# Altium schematic sheet 3_baseband.SchDoc: LoRa Baseband processor
size A4; OrganizationName: Pluton UPV; Address1: Universitat Politècnica; Address2: de València (UPV); Address3: Camí de Vera, València; Address4: Spain; SheetNumber: 3; SheetTotal: 6
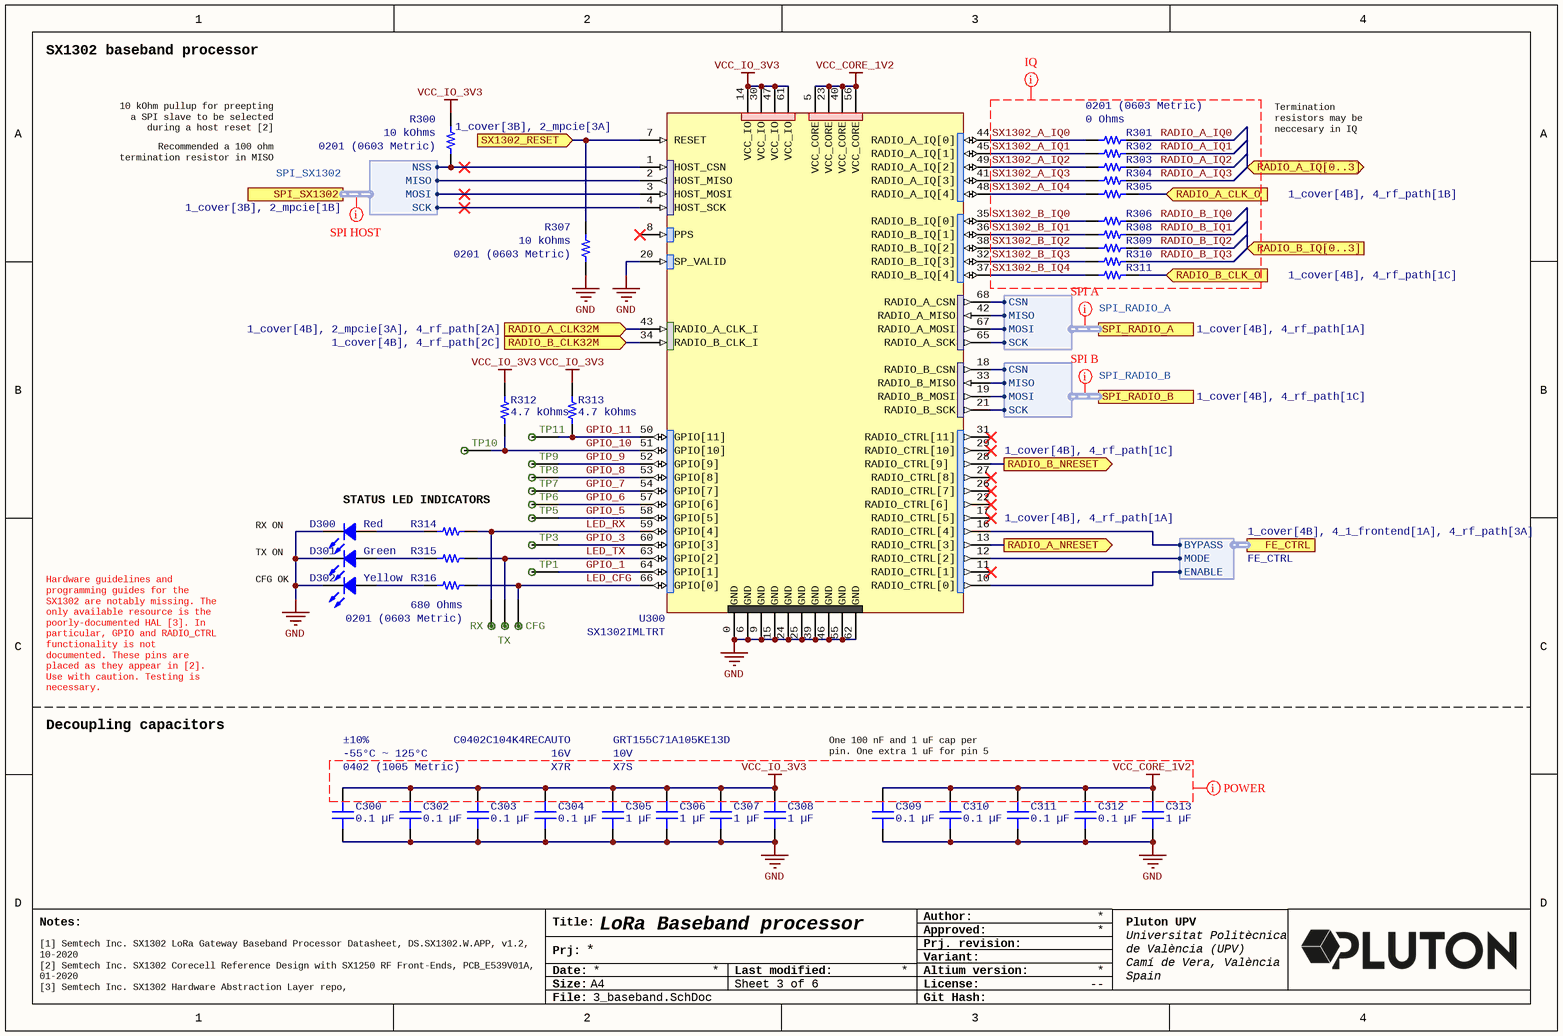
[diagram p0: 3_baseband.SchDoc]

## Parts
C300  Part Number: C0402C104K4RECAUTO  Operating Temperature: -55°C ~ 125°C  Package / Case: 0402 (1005 Metric)  Temperature Coefficient: X7R  Tolerance: ±10%  Voltage - Rated: 16V  [CAP 0402_1005]  (hidden comment: 0.1 µF)
C302  0.1 µF  [CAP 0402_1005]
C303  0.1 µF  [CAP 0402_1005]
C304  0.1 µF  [CAP 0402_1005]
C305  Part Number: GRT155C71A105KE13D  Temperature Coefficient: X7S  Voltage - Rated: 10V  [CAP 0402_1005]  (hidden comment: 1 µF)
C306  1 µF  [CAP 0402_1005]
C307  1 µF  [CAP 0402_1005]
C308  1 µF  [CAP 0402_1005]
C309  0.1 µF  [CAP 0402_1005]
C310  0.1 µF  [CAP 0402_1005]
C311  0.1 µF  [CAP 0402_1005]
C312  0.1 µF  [CAP 0402_1005]
C313  1 µF  [CAP 0402_1005]
CFG  (no value)  [testpoint_via]  (no BOM)
D300  Red  [LED 0402_1005 RED]
D301  Green  [LED 0402_1005 GREEN]
D302  Yellow  [LED 0402_1005 YELLOW]
R300  Package / Case: 0201 (0603 Metric)  [RES 0201_0603]  (hidden comment: 10 kOhms)
R301  Device Package: 0201 (0603 Metric)  [RES 0201_0603]  (hidden comment: 0 Ohms)
R302  0 Ohms  [RES 0201_0603]  (value not drawn)
R303  0 Ohms  [RES 0201_0603]  (value not drawn)
R304  0 Ohms  [RES 0201_0603]  (value not drawn)
R305  0 Ohms  [RES 0201_0603]  (value not drawn)
R306  0 Ohms  [RES 0201_0603]  (value not drawn)
R307  Package / Case: 0201 (0603 Metric)  [RES 0201_0603]  (hidden comment: 10 kOhms)
R308  0 Ohms  [RES 0201_0603]  (value not drawn)
R309  0 Ohms  [RES 0201_0603]  (value not drawn)
R310  0 Ohms  [RES 0201_0603]  (value not drawn)
R311  0 Ohms  [RES 0201_0603]  (value not drawn)
R312  4.7 kOhms  [RES 0201_0603]
R313  4.7 kOhms  [RES 0201_0603]
R314  680 Ohms  [RES 0201_0603]  (value not drawn)
R315  680 Ohms  [RES 0201_0603]  (value not drawn)
R316  Device Package: 0201 (0603 Metric)  [RES 0201_0603]  (hidden comment: 680 Ohms)
RX  (no value)  [testpoint_via]  (no BOM)
TP1  (no value)  [testpoint_pad]  (no BOM)
TP3  (no value)  [testpoint_pad]  (no BOM)
TP5  (no value)  [testpoint_pad]  (no BOM)
TP6  (no value)  [testpoint_pad]  (no BOM)
TP7  (no value)  [testpoint_pad]  (no BOM)
TP8  (no value)  [testpoint_pad]  (no BOM)
TP9  (no value)  [testpoint_pad]  (no BOM)
TP10  (no value)  [testpoint_pad]  (no BOM)
TP11  (no value)  [testpoint_pad]  (no BOM)
TX  (no value)  [testpoint_via]  (no BOM)
U300  SX1302IMLTRT  [QFN-68]

## Ports
FE_CTRL (harness FE_CTRL, see 1_cover[4B], 4_1_frontend[1A], 4_rf_path[3A]), RADIO_A_CLK32M (in, see 1_cover[4B], 2_mpcie[3A], 4_rf_path[2A]), RADIO_A_CLK_O (in, see 1_cover[4B], 4_rf_path[1B]), RADIO_A_IQ[0..3] (bidir, see 1_cover[4B], 4_rf_path[1B]), RADIO_A_NRESET (out, see 1_cover[4B], 4_rf_path[1A]), RADIO_B_CLK32M (in, see 1_cover[4B], 4_rf_path[2C]), RADIO_B_CLK_O (in, see 1_cover[4B], 4_rf_path[1C]), RADIO_B_IQ[0..3] (in, see 1_cover[4B], 4_rf_path[1C]), RADIO_B_NRESET (out, see 1_cover[4B], 4_rf_path[1C]), SPI_RADIO_A (harness SPI_RADIO_A, see 1_cover[4B], 4_rf_path[1A]), SPI_RADIO_B (harness SPI_RADIO_B, see 1_cover[4B], 4_rf_path[1C]), SPI_SX1302 (harness SPI_SX1302, see 1_cover[3B], 2_mpcie[1B]), SX1302_RESET (in, see 1_cover[3B], 2_mpcie[3A])

## Harnesses
SPI_RADIO_A: CSN, MISO, MOSI, SCK
SPI_RADIO_B: CSN, MISO, MOSI, SCK
SPI_SX1302: SCK, MISO, MOSI, NSS
FE_CTRL: MODE, ENABLE, BYPASS

## Nets
GND: C300.1 C302.1 C303.1 C304.1 C305.1 C306.1 C307.1 C308.1 C309.1 C310.1 C311.1 C312.1 C313.1 D300.2 D301.2 D302.2 R307.2 U300.0(GND) U300.6(GND) U300.9(GND) U300.15(GND) U300.20(SP_VALID) U300.24(GND) U300.25(GND) U300.39(GND) U300.46(GND) U300.55(GND) U300.62(GND)
VCC_CORE_1V2: C309.2 C310.2 C311.2 C312.2 C313.2 U300.5(VCC_CORE) U300.23(VCC_CORE) U300.40(VCC_CORE) U300.56(VCC_CORE)
VCC_IO_3V3: C300.2 C302.2 C303.2 C304.2 C305.2 C306.2 C307.2 C308.2 R300.1 R312.2 R313.2 U300.14(VCC_IO) U300.30(VCC_IO) U300.47(VCC_IO) U300.61(VCC_IO)
GPIO_1: TP1.0 U300.64(GPIO[1])
GPIO_3: TP3.0 U300.60(GPIO[3])
GPIO_5: TP5.0 U300.58(GPIO[5])
GPIO_6: TP6.0 U300.57(GPIO[6])
GPIO_7: TP7.0 U300.54(GPIO[7])
GPIO_8: TP8.0 U300.53(GPIO[8])
GPIO_9: TP9.0 U300.52(GPIO[9])
GPIO_10: R312.1 TP10.0 U300.51(GPIO[10])
GPIO_11: R313.1 TP11.0 U300.50(GPIO[11])
LED_CFG: CFG.0 R316.2 U300.66(GPIO[0])
LED_RX: R314.2 RX.0 U300.59(GPIO[4])
LED_TX: R315.2 TX.0 U300.63(GPIO[2])
RADIO_A_CLK32M: U300.43(RADIO_A_CLK_I) ; port RADIO_A_CLK32M
RADIO_A_CLK_O: R305.2 ; port RADIO_A_CLK_O
RADIO_A_IQ0: R301.2
RADIO_A_IQ1: R302.2
RADIO_A_IQ2: R303.2
RADIO_A_IQ3: R304.2
RADIO_A_NRESET: U300.13(RADIO_CTRL[3]) ; port RADIO_A_NRESET
RADIO_B_CLK32M: U300.34(RADIO_B_CLK_I) ; port RADIO_B_CLK32M
RADIO_B_CLK_O: R311.2 ; port RADIO_B_CLK_O
RADIO_B_IQ0: R306.2
RADIO_B_IQ1: R308.2
RADIO_B_IQ2: R309.2
RADIO_B_IQ3: R310.2
RADIO_B_NRESET: U300.28(RADIO_CTRL[9]) ; port RADIO_B_NRESET
SX1302_A_IQ0: R301.1 U300.44(RADIO_A_IQ[0])
SX1302_A_IQ1: R302.1 U300.45(RADIO_A_IQ[1])
SX1302_A_IQ2: R303.1 U300.49(RADIO_A_IQ[2])
SX1302_A_IQ3: R304.1 U300.41(RADIO_A_IQ[3])
SX1302_A_IQ4: R305.1 U300.48(RADIO_A_IQ[4])
SX1302_B_IQ0: R306.1 U300.35(RADIO_B_IQ[0])
SX1302_B_IQ1: R308.1 U300.36(RADIO_B_IQ[1])
SX1302_B_IQ2: R309.1 U300.38(RADIO_B_IQ[2])
SX1302_B_IQ3: R310.1 U300.32(RADIO_B_IQ[3])
SX1302_B_IQ4: R311.1 U300.37(RADIO_B_IQ[4])
SX1302_RESET: R307.1 U300.7(RESET) ; port SX1302_RESET
NetD300_1: D300.1 R314.1
NetD301_1: D301.1 R315.1
NetD302_1: D302.1 R316.1
NetR300_2: R300.2 U300.1(HOST_CSN) ; port SPI_SX1302.NSS
NetU300_2: U300.2(HOST_MISO) ; port SPI_SX1302.MISO
NetU300_3: U300.3(HOST_MOSI) ; port SPI_SX1302.MOSI
NetU300_4: U300.4(HOST_SCK) ; port SPI_SX1302.SCK
NetU300_10: U300.10(RADIO_CTRL[0]) ; port FE_CTRL.ENABLE
NetU300_12: U300.12(RADIO_CTRL[2]) ; port FE_CTRL.MODE
NetU300_16: U300.16(RADIO_CTRL[4]) ; port FE_CTRL.BYPASS
NetU300_18: U300.18(RADIO_B_CSN) ; port SPI_RADIO_B.CSN
NetU300_19: U300.19(RADIO_B_MOSI) ; port SPI_RADIO_B.MOSI
NetU300_21: U300.21(RADIO_B_SCK) ; port SPI_RADIO_B.SCK
NetU300_33: U300.33(RADIO_B_MISO) ; port SPI_RADIO_B.MISO
NetU300_42: U300.42(RADIO_A_MISO) ; port SPI_RADIO_A.MISO
NetU300_65: U300.65(RADIO_A_SCK) ; port SPI_RADIO_A.SCK
NetU300_67: U300.67(RADIO_A_MOSI) ; port SPI_RADIO_A.MOSI
NetU300_68: U300.68(RADIO_A_CSN) ; port SPI_RADIO_A.CSN

Not connected (* = marked no-connect by the designer): U300 8(PPS)* 11(RADIO_CTRL[1])* 17(RADIO_CTRL[5])* 22(RADIO_CTRL[6]_)* 26(RADIO_CTRL[7])* 27(RADIO_CTRL[8])* 29(RADIO_CTRL[10])* 31(RADIO_CTRL[11])*

## Layout directives
net class SPI HOST; rule Matched Net Lengths [Tolerance = 20mm]: (no net found under the mark)
net class IQ; rule Matched Net Lengths [Tolerance = 20mm]: RADIO_A_IQ0, RADIO_A_IQ1, RADIO_A_IQ2, RADIO_A_IQ3, RADIO_B_IQ0, RADIO_B_IQ1, RADIO_B_IQ2, RADIO_B_IQ3, SX1302_A_IQ0, SX1302_A_IQ1, SX1302_A_IQ2, SX1302_A_IQ3, SX1302_A_IQ4, SX1302_B_IQ0, SX1302_B_IQ1, SX1302_B_IQ2, SX1302_B_IQ3, SX1302_B_IQ4
net class SPI A; rule Matched Net Lengths [Tolerance = 20mm]: (no net found under the mark)
net class SPI B; rule Matched Net Lengths [Tolerance = 20mm]: (no net found under the mark)
rule Width Constraint [Pref Width = 0.4mm    Min Width = 0.2mm    Max Width = 0.5mm]; net class POWER: VCC_CORE_1V2, VCC_IO_3V3

## Notes on the sheet
- SX1302 baseband processor
- Recommended a 100 ohm
  termination resistor in MISO [2]
- 10 kOhm pullup for preepting
  a SPI slave to be selected
  during a host reset [2]
- Termination resistors may be neccesary in IQ pins [2]
- STATUS LED INDICATORS
- CFG OK
- TX ON
- RX ON
- Hardware guidelines and programming guides for the SX1302 are notably missing. The only available resource is the poorly-documented HAL [3]. In particular, GPIO and RADIO_CTRL functionality is not documented. These pins are placed as they appear in [2].
  Use with caution. Testing is necessary.
- Decoupling capacitors
- One 100 nF and 1 uF cap per pin. One extra 1 uF for pin 5 [2]
- [1] Semtech Inc. SX1302 LoRa Gateway Baseband Processor Datasheet, DS.SX1302.W.APP, v1.2, 10-2020
  [2] Semtech Inc. SX1302 Corecell Reference Design with SX1250 RF Front-Ends, PCB_E539V01A, 01-2020
  [3] Semtech Inc. SX1302 Hardware Abstraction Layer repo, https://github.com/Lora-net/sx1302_hal
- Notes:
- Title:
- Author:
- Approved:
- Date:
- Prj:
- Size:
- A4
- Last modified:
- Altium version:
- Variant:
- Prj. revision:
- License:
- --
- File:
- Git Hash:

## Library data of the parts
C300 C302-C304 C309-C312 = C0402C104K4RECAUTO: CAP CER 0402 0.1UF 16V X7R 10%; manufacturer: KEMET; Value: 0.1 µF; Applications: Automotive, ESD Protection; Capacitance: 0.1 µF; componentlink1description: Datasheet; componentlink1url: https://api.kemet.com/component-edge/download/datasheet/C0402C104K4RECAUTO.pdf; componentlink2description: DigiKey Link; componentlink2url: https://www.digikey.com/en/products/detail/kemet/C0402C104K4RECAUTO/8563695; Device Package: 0402 (1005 Metric); lastupdated: 09/02/2024 20:04:38; Lifecycle Status: Active; Minimum Order: 1; Mounting Type: Surface Mount, MLCC; packaging: TapeAndReel; partid: 1731; Part Status: Active; price: 0.01; Ratings: AEC-Q200; series: ESD SMD Auto X7R; Size / Dimension: 0.039" L x 0.020" W (1.00mm x 0.50mm); Supplier 1: DigiKey; Supplier Part Number 1: 399-17167-1-ND; Thickness (Max): 0.022" (0.55mm)
  C302-C304 C309-C312: Part Number: C0402C104K4RECAUTO; Operating Temperature: -55°C ~ 125°C; Package / Case: 0402 (1005 Metric); Temperature Coefficient: X7R; Tolerance: ±10%; Voltage - Rated: 16V
C305-C308 C313 = GRT155C71A105KE13D: CAP CER 1UF 10V X7S 0402; manufacturer: Murata Electronics; Tolerance: ±10%; Value: 1 µF; Applications: Automotive; Capacitance: 1 µF; componentlink1description: Datasheet; componentlink1url: https://search.murata.co.jp/Ceramy/image/img/A01X/G101/ENG/GRT155C71A105KE13-01.pdf; componentlink2description: DigiKey Link; componentlink2url: https://www.digikey.com/en/products/detail/murata-electronics/GRT155C71A105KE13D/10695747; Device Package: 0402 (1005 Metric); lastupdated: 09/02/2024 20:04:05; Lifecycle Status: Active; Minimum Order: 1; Mounting Type: Surface Mount, MLCC; Operating Temperature: -55°C ~ 125°C; Package / Case: 0402 (1005 Metric); packaging: TapeAndReel; partid: 47127; Part Status: Active; price: 0.04; Ratings: AEC-Q200; series: GRT; Size / Dimension: 0.039" L x 0.020" W (1.00mm x 0.50mm); Supplier 1: DigiKey; Supplier Part Number 1: 490-GRT155C71A105KE13DCT-ND; Thickness (Max): 0.024" (0.60mm)
  C306-C308 C313: Part Number: GRT155C71A105KE13D; Temperature Coefficient: X7S; Voltage - Rated: 10V
CFG RX TX = TestPoint-VIA: Test point, thru-hole
D300 = EAST10053RA0: LED RED CLEAR 2SMD; Manufacturer: Everlight Electronics Co Ltd; Configuration: Standard; Current - Test: 5mA; Lens Color: Colorless; Lens Size: 1.00mm x 0.50mm; Lens Style: Rectangle with Flat Top; Viewing Angle: 120°; Voltage - Forward (Vf) (Typ): 2.05V; Wavelength - Peak: 639nm; Part Number: EAST10053RA0; Color: Red; ComponentLink1Description: Datasheet; ComponentLink1URL: https://everlightamericas.com/index.php?controller=attachment&id_attachment=3575; ComponentLink2Description: DigiKey Link; ComponentLink2URL: https://www.digikey.com/en/products/detail/everlight-electronics-co-ltd/EAST10053RA0/8510365; Device Package: 0402 (1005 Metric); Height (Max): 0.35mm; LastUpdated: 03/06/2024 19:59:17; Lens Transparency: Clear; Lifecycle Status: Active; Minimum Order: 1; Mounting Type: Surface Mount; Package / Case: 0402 (1005 Metric); Packaging: TapeAndReel; PartId: 508; Part Status: Active; Price: 0.05; Series: -; Size / Dimension: 1.00mm L x 0.50mm W; Supplier 1: DigiKey; Supplier Part Number 1: 1080-1556-1-ND; Supplier Device Package: 2-SMD; Value: Red
D301 = EAST10052GA0: LED GREEN CLEAR 2SMD; Manufacturer: Everlight Electronics Co Ltd; Configuration: Standard; Current - Test: 5mA; Lens Color: Colorless; Lens Size: 1.00mm x 0.50mm; Lens Style: Rectangle with Flat Top; Viewing Angle: 120°; Voltage - Forward (Vf) (Typ): 2.95V; Wavelength - Peak: 518nm; Part Number: EAST10052GA0; Color: Green; ComponentLink1Description: Datasheet; ComponentLink1URL: https://everlightamericas.com/index.php?controller=attachment&id_attachment=3256; ComponentLink2Description: DigiKey Link; ComponentLink2URL: https://www.digikey.com/en/products/detail/everlight-electronics-co-ltd/EAST10052GA0/8510366; Device Package: 0402 (1005 Metric); Height (Max): 0.25mm; LastUpdated: 03/06/2024 19:58:14; Lens Transparency: Clear; Lifecycle Status: Active; Minimum Order: 1; Mounting Type: Surface Mount; Package / Case: 0402 (1005 Metric); Packaging: TapeAndReel; PartId: 696; Part Status: Active; Price: 0.09; Series: -; Size / Dimension: 1.00mm L x 0.50mm W; Supplier 1: DigiKey; Supplier Part Number 1: 1080-1557-1-ND; Supplier Device Package: 2-SMD; Value: Green
D302 = FHY1105P-TR: LED YELLOW CLEAR 1005 SMD; Manufacturer: Stanley Electric Co; Configuration: Standard; Current - Test: 5mA; Lens Color: Colorless; Lens Size: 1.00mm x 0.50mm; Lens Style: Rectangle with Flat Top; Millicandela Rating: 32mcd; Voltage - Forward (Vf) (Typ): 1.9V; Wavelength - Dominant: 590nm; Wavelength - Peak: 594nm; Part Number: FHY1105P-TR; Color: Yellow; ComponentLink1Description: Datasheet; ComponentLink1URL: http://www.stanley-components.com/php/downloaddatafile.php?rp=0,FHY1105P-TR_e.pdf; ComponentLink2Description: DigiKey Link; ComponentLink2URL: https://www.digikey.com/en/products/detail/stanley-electric-co/FHY1105P-TR/6205303; Device Package: 0402 (1005 Metric); Height (Max): 0.25mm; LastUpdated: 03/06/2024 20:00:47; Lens Transparency: Clear; Lifecycle Status: Active; Minimum Order: 1; Mounting Type: Surface Mount; Package / Case: 0402 (1005 Metric); Packaging: TapeAndReel; PartId: 166; Part Status: Active; Price: 0.05; Series: -; Size / Dimension: 1.00mm L x 0.50mm W; Supplier 1: DigiKey; Supplier Part Number 1: 404-1209-1-ND; Supplier Device Package: 1005; Value: Yellow
R300 R307 = AF0201FR-0710KL: RES SMD 10K OHM 1% 1/20W 0201; Manufacturer: Yageo; Power (Watts): 0.05W, 1/20W; Temperature Coefficient: ±200ppm/°C; Part Number: AF0201FR-0710KL; Value: 10 kOhms; ComponentLink1Description: Datasheet; ComponentLink1URL: https://www.yageo.com/upload/media/product/productsearch/datasheet/rchip/PYu-AF_51_RoHS_L_9.pdf; ComponentLink2Description: DigiKey Link; ComponentLink2URL: https://www.digikey.com/en/products/detail/yageo/AF0201FR-0710KL/5900138; Composition: Thick Film; Device Package: 0201 (0603 Metric); Features: Anti-Sulfur, Automotive AEC-Q200; Height - Seated (Max): 0.010" (0.26mm); LastUpdated: 04/06/2024 19:11:47; Lifecycle Status: Active; Minimum Order: 1; Number of Terminations: 2; Operating Temperature: -55°C ~ 125°C; Packaging: TapeAndReel; PartId: 78061; Part Status: Active; Price: 0.01; Ratings: AEC-Q200; Resistance: 10 kOhms; Series: AF; Size / Dimension: 0.024" L x 0.012" W (0.60mm x 0.30mm); Supplier 1: DigiKey; Supplier Part Number 1: 13-AF0201FR-0710KLCT-ND; Supplier Device Package: 0201; Tolerance: ±1%
R301-R306 R308-R311 = AC0201JR-070RL: RES SMD 0 OHM JUMPER 1/20W 0201; Manufacturer: Yageo; Power (Watts): 0.05W, 1/20W; Part Number: AC0201JR-070RL; Value: 0 Ohms; ComponentLink1Description: Datasheet; ComponentLink1URL: https://www.yageo.com/upload/media/product/productsearch/datasheet/rchip/PYu-AC_51_RoHS_L_7.pdf; ComponentLink2Description: DigiKey Link; ComponentLink2URL: https://www.digikey.com/en/products/detail/yageo/AC0201JR-070RL/5894880; Composition: Thick Film; Features: Automotive AEC-Q200, Moisture Resistant; Height - Seated (Max): 0.010" (0.26mm); LastUpdated: 04/06/2024 19:12:00; Lifecycle Status: Active; Minimum Order: 1; Number of Terminations: 2; Operating Temperature: -55°C ~ 155°C; Package / Case: 0201 (0603 Metric); Packaging: CutTape; PartId: 818; Part Status: Active; Price: 0.01; Ratings: AEC-Q200; Resistance: 0 Ohms; Series: AC; Size / Dimension: 0.024" L x 0.012" W (0.60mm x 0.30mm); Supplier 1: DigiKey; Supplier Part Number 1: YAG3427CT-ND; Supplier Device Package: 0201; Tolerance: Jumper
  R302-R306 R308-R311: Device Package: 0201 (0603 Metric)
R312 R313 = AC0201FR-074K7L: RES SMD 4.7K OHM 1% 1/20W 0201; Manufacturer: Yageo; Power (Watts): 0.05W, 1/20W; Temperature Coefficient: ±200ppm/°C; Part Number: AC0201FR-074K7L; Value: 4.7 kOhms; ComponentLink1Description: Datasheet; ComponentLink1URL: https://www.yageo.com/upload/media/product/productsearch/datasheet/rchip/PYu-AC_51_RoHS_L_7.pdf; ComponentLink2Description: DigiKey Link; ComponentLink2URL: https://www.digikey.com/en/products/detail/yageo/AC0201FR-074K7L/5894686; Composition: Thick Film; Device Package: 0201 (0603 Metric); Features: Automotive AEC-Q200, Moisture Resistant; Height - Seated (Max): 0.010" (0.26mm); LastUpdated: 04/06/2024 19:11:59; Lifecycle Status: Active; Minimum Order: 1; Number of Terminations: 2; Operating Temperature: -55°C ~ 155°C; Package / Case: 0201 (0603 Metric); Packaging: CutTape; PartId: 978; Part Status: Active; Price: 0.01; Ratings: AEC-Q200; Resistance: 4.7 kOhms; Series: AC; Size / Dimension: 0.024" L x 0.012" W (0.60mm x 0.30mm); Supplier 1: DigiKey; Supplier Part Number 1: YAG3426CT-ND; Supplier Device Package: 0201; Tolerance: ±1%
R314-R316 = RC0201JR-07680RL: RES 680 OHM 5% 1/20W 0201; Manufacturer: Yageo; Power (Watts): 0.05W, 1/20W; Temperature Coefficient: ±200ppm/°C; Part Number: RC0201JR-07680RL; Value: 680 Ohms; ComponentLink1Description: Datasheet; ComponentLink1URL: https://www.yageo.com/upload/media/product/productsearch/datasheet/rchip/PYu-RC_Group_51_RoHS_L_10.pdf; ComponentLink2Description: DigiKey Link; ComponentLink2URL: https://www.digikey.com/en/products/detail/yageo/RC0201JR-07680RL/1948962; Composition: Thick Film; Features: Moisture Resistant; Height - Seated (Max): 0.010" (0.26mm); LastUpdated: 04/06/2024 19:12:00; Lifecycle Status: Active; Minimum Order: 1; Number of Terminations: 2; Operating Temperature: -55°C ~ 125°C; Package / Case: 0201 (0603 Metric); Packaging: CutTape; PartId: 715; Part Status: Active; Price: 0.01; Resistance: 680 Ohms; Series: RC_L; Size / Dimension: 0.024" L x 0.012" W (0.60mm x 0.30mm); Supplier 1: DigiKey; Supplier Part Number 1: 311-680NCT-ND; Supplier Device Package: 0201; Tolerance: ±5%
  R314 R315: Device Package: 0201 (0603 Metric)
TP1 TP3 TP5-TP11 = TestPoint-PAD: Test point, pad
U300 = SX1302IMLTRT: Baseband LoRa chip for gateways; ComponentLink1Description: Mouser; ComponentLink1URL: https://www.mouser.es/ProductDetail/Semtech/SX1302IMLTRT?qs=bZr6mbWTK5nALa%252B96PTK0Q%3D%3D